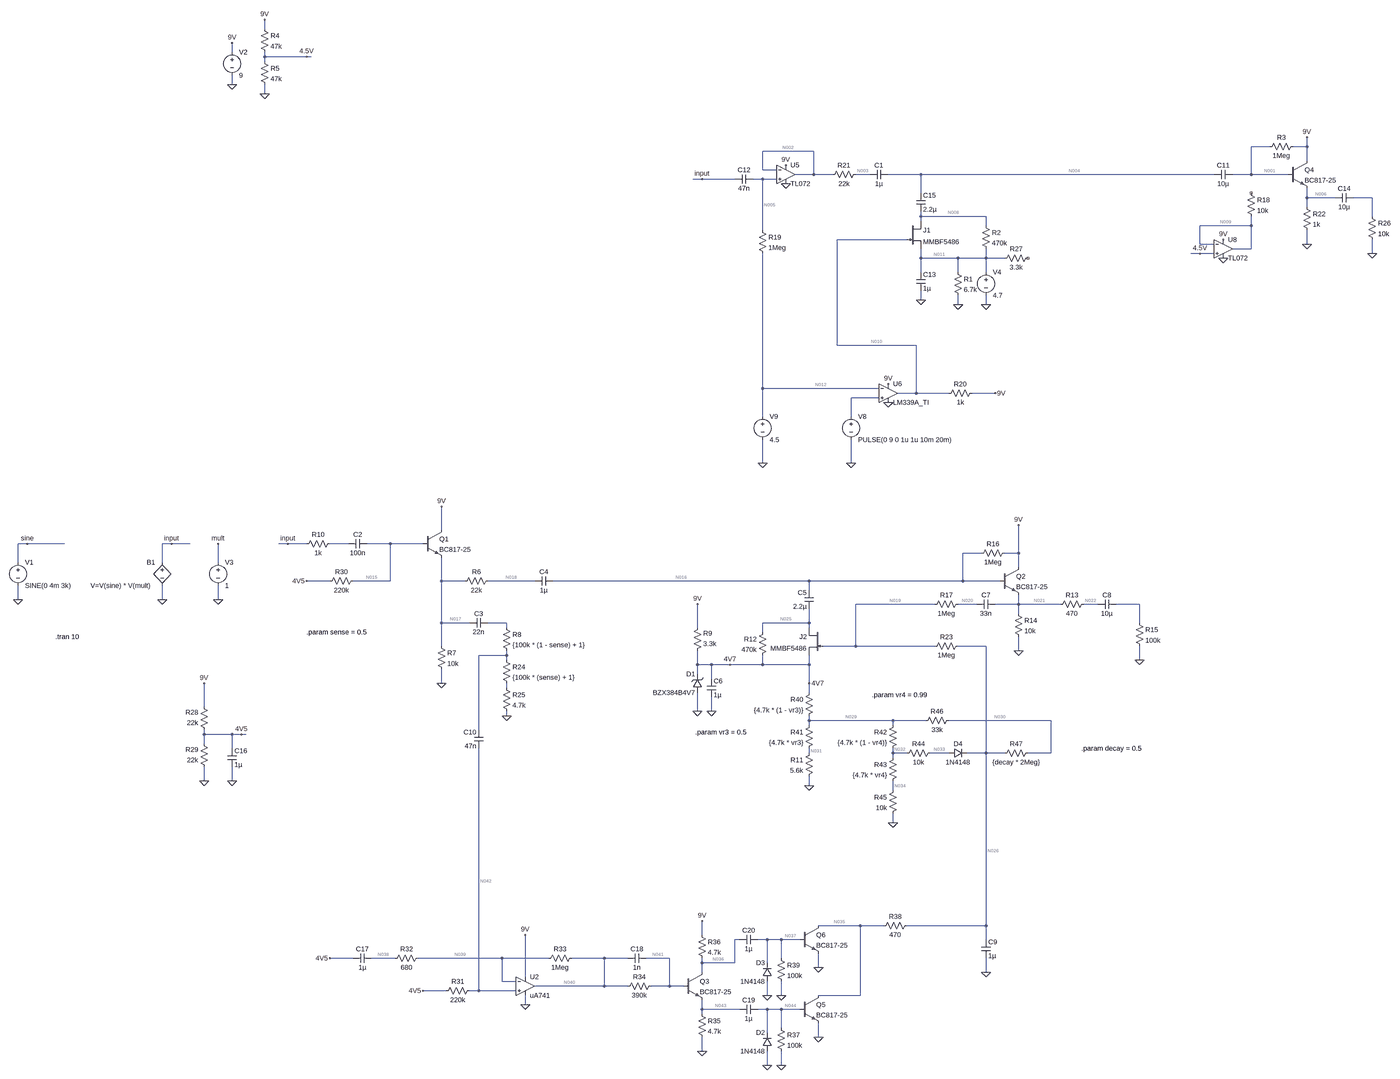
[diagram p0: schematic boss_NF1.asc, whole sheet]
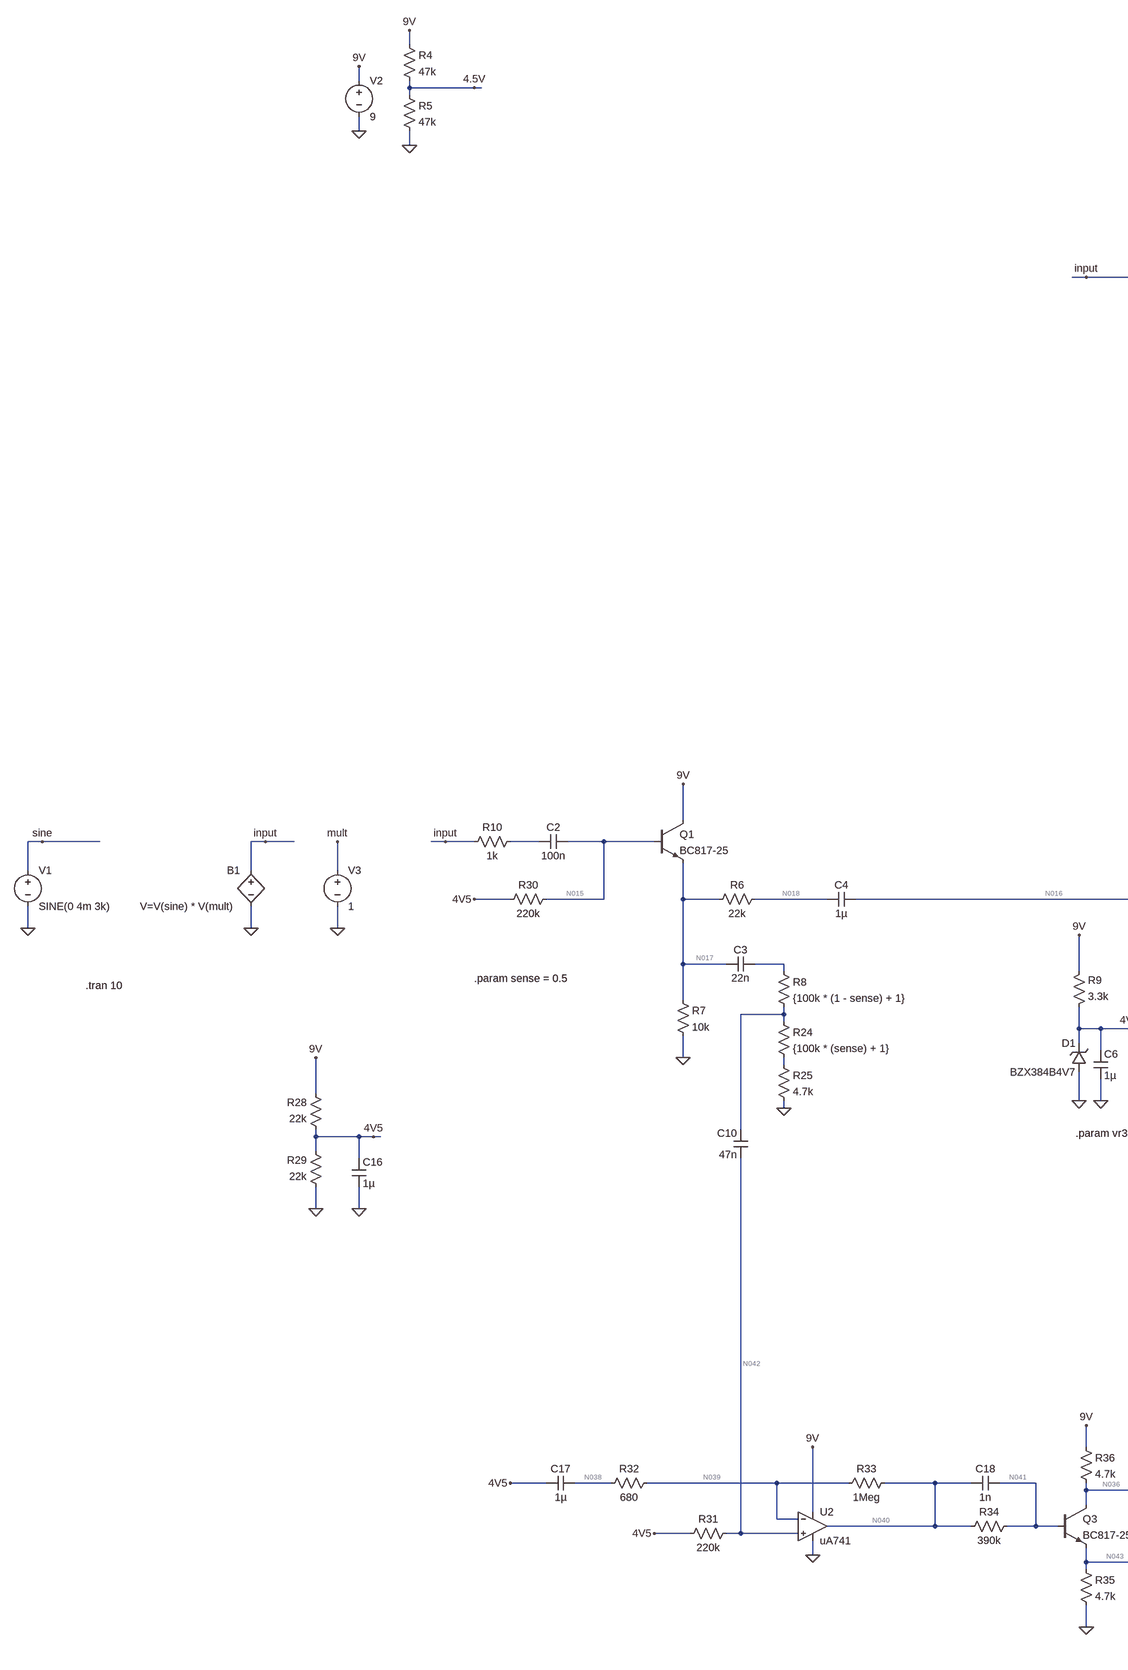
[diagram p1: schematic boss_NF1.asc, part, row 1 of 1, column 1 of 2]
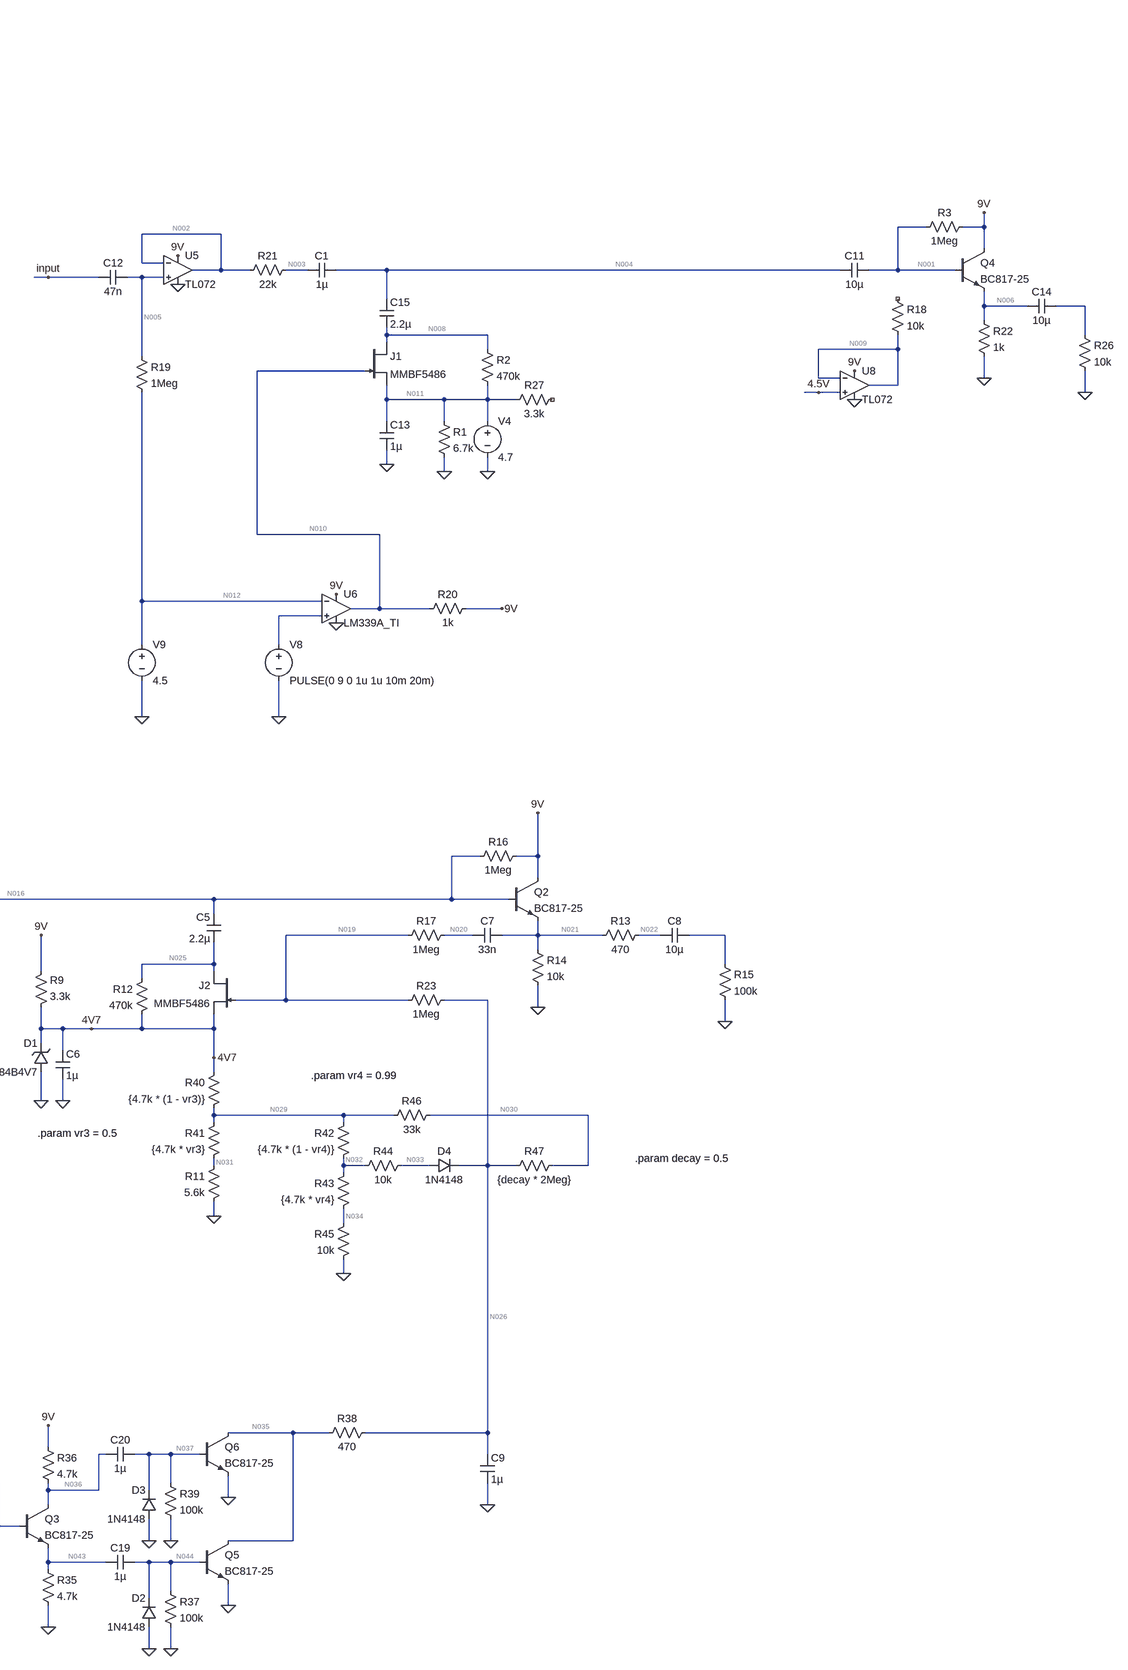
[diagram p2: schematic boss_NF1.asc, part, row 1 of 1, column 2 of 2]
boss_NF1.asc, the LTspice schematic file:
Version 4
SHEET 1 4932 4532
WIRE -656 -464 -656 -496
WIRE -768 -384 -768 -416
WIRE -656 -368 -656 -384
WIRE -512 -368 -656 -368
WIRE -496 -368 -512 -368
WIRE -656 -352 -656 -368
WIRE -768 -272 -768 -304
WIRE -656 -240 -656 -272
WIRE 2848 176 2784 176
WIRE 2976 176 2976 144
WIRE 2976 176 2928 176
WIRE 1232 192 1056 192
WIRE 2976 224 2976 176
WIRE 1056 256 1056 192
WIRE 1104 256 1056 256
WIRE 1232 272 1232 192
WIRE 1232 272 1168 272
WIRE 1296 272 1232 272
WIRE 1424 272 1376 272
WIRE 1600 272 1488 272
WIRE 2656 272 1600 272
WIRE 2784 272 2784 176
WIRE 2784 272 2720 272
WIRE 2912 272 2784 272
WIRE 848 288 816 288
WIRE 960 288 848 288
WIRE 1056 288 1024 288
WIRE 1104 288 1056 288
WIRE 1600 336 1600 272
WIRE 2976 352 2976 320
WIRE 3072 352 2976 352
WIRE 3200 352 3136 352
WIRE 2976 384 2976 352
WIRE 1600 416 1600 400
WIRE 1824 416 1600 416
WIRE 3200 416 3200 352
WIRE 1600 432 1600 416
WIRE 1824 448 1824 416
WIRE 2784 448 2784 416
WIRE 2784 448 2608 448
WIRE 1056 464 1056 288
WIRE 1552 496 1312 496
WIRE 2608 512 2608 448
WIRE 2656 512 2608 512
WIRE 2976 512 2976 464
WIRE 2784 528 2784 448
WIRE 2784 528 2720 528
WIRE 2608 544 2576 544
WIRE 2656 544 2608 544
WIRE 3200 544 3200 496
WIRE 1600 560 1600 528
WIRE 1728 560 1600 560
WIRE 1824 560 1824 528
WIRE 1824 560 1728 560
WIRE 1888 560 1824 560
WIRE 1600 608 1600 560
WIRE 1728 608 1728 560
WIRE 1824 608 1824 560
WIRE 1600 704 1600 672
WIRE 1728 720 1728 688
WIRE 1824 720 1824 688
WIRE 1312 880 1312 496
WIRE 1584 880 1312 880
WIRE 1056 1040 1056 544
WIRE 1456 1040 1056 1040
WIRE 1584 1056 1584 880
WIRE 1584 1056 1520 1056
WIRE 1696 1056 1584 1056
WIRE 1856 1056 1776 1056
WIRE 1456 1072 1360 1072
WIRE 1056 1136 1056 1040
WIRE 1360 1136 1360 1072
WIRE 1056 1296 1056 1216
WIRE 1360 1296 1360 1216
WIRE -48 2416 -48 2336
WIRE -1472 2464 -1504 2464
WIRE -1344 2464 -1472 2464
WIRE -976 2464 -1008 2464
WIRE -912 2464 -976 2464
WIRE -576 2464 -608 2464
WIRE -512 2464 -576 2464
WIRE -368 2464 -432 2464
WIRE -224 2464 -304 2464
WIRE -112 2464 -224 2464
WIRE 1808 2496 1744 2496
WIRE 1936 2496 1936 2400
WIRE 1936 2496 1888 2496
WIRE -1504 2528 -1504 2464
WIRE -1008 2528 -1008 2464
WIRE -816 2528 -816 2464
WIRE 1936 2544 1936 2496
WIRE -432 2592 -512 2592
WIRE -224 2592 -224 2464
WIRE -224 2592 -352 2592
WIRE -48 2592 -48 2512
WIRE 32 2592 -48 2592
WIRE 272 2592 112 2592
WIRE 1216 2592 336 2592
WIRE 1744 2592 1744 2496
WIRE 1744 2592 1216 2592
WIRE 1872 2592 1744 2592
WIRE 1216 2624 1216 2592
WIRE -1504 2656 -1504 2608
WIRE -1008 2656 -1008 2608
WIRE -816 2656 -816 2608
WIRE 1648 2672 1376 2672
WIRE 1792 2672 1728 2672
WIRE 1936 2672 1936 2640
WIRE 1936 2672 1856 2672
WIRE 2080 2672 1936 2672
WIRE 2208 2672 2160 2672
WIRE 2352 2672 2272 2672
WIRE 1936 2704 1936 2672
WIRE -48 2736 -48 2592
WIRE 48 2736 -48 2736
WIRE 176 2736 112 2736
WIRE 1216 2736 1216 2688
WIRE 1216 2736 1056 2736
WIRE 2352 2736 2352 2672
WIRE 176 2752 176 2736
WIRE 832 2752 832 2672
WIRE 1216 2752 1216 2736
WIRE 1056 2768 1056 2736
WIRE -48 2816 -48 2736
WIRE 1376 2816 1376 2672
WIRE 1376 2816 1264 2816
WIRE 1648 2816 1376 2816
WIRE 1824 2816 1728 2816
WIRE 1936 2832 1936 2784
WIRE 176 2848 176 2832
WIRE 176 2848 80 2848
WIRE 176 2864 176 2848
WIRE 2352 2864 2352 2816
WIRE 832 2880 832 2832
WIRE 880 2880 832 2880
WIRE 944 2880 880 2880
WIRE 1056 2880 1056 2848
WIRE 1056 2880 944 2880
WIRE 1216 2880 1216 2848
WIRE 1216 2880 1056 2880
WIRE 832 2912 832 2880
WIRE 880 2928 880 2880
WIRE -48 2944 -48 2896
WIRE 1216 2944 1216 2880
WIRE 176 2960 176 2944
WIRE 1216 2976 1216 2944
WIRE -864 3024 -864 2944
WIRE 832 3040 832 2976
WIRE 880 3040 880 2992
WIRE 176 3056 176 3040
WIRE 1216 3072 1216 3056
WIRE 1504 3072 1216 3072
WIRE 1616 3072 1504 3072
WIRE 2048 3072 1696 3072
WIRE 1216 3088 1216 3072
WIRE 1504 3088 1504 3072
WIRE 80 3104 80 2848
WIRE -864 3120 -864 3104
WIRE -768 3120 -864 3120
WIRE -736 3120 -768 3120
WIRE -720 3120 -736 3120
WIRE -864 3152 -864 3120
WIRE -768 3168 -768 3120
WIRE 1216 3184 1216 3168
WIRE 1504 3184 1504 3168
WIRE 1552 3184 1504 3184
WIRE 1696 3184 1632 3184
WIRE 1824 3184 1824 2816
WIRE 1824 3184 1760 3184
WIRE 1888 3184 1824 3184
WIRE 2048 3184 2048 3072
WIRE 2048 3184 1968 3184
WIRE 1504 3200 1504 3184
WIRE -864 3280 -864 3232
WIRE -768 3280 -768 3232
WIRE 1216 3296 1216 3264
WIRE 1504 3312 1504 3280
WIRE 1504 3424 1504 3392
WIRE 1392 3856 1248 3856
WIRE 1472 3856 1392 3856
WIRE 1824 3856 1824 3184
WIRE 1824 3856 1552 3856
WIRE 848 3888 848 3840
WIRE 976 3904 960 3904
WIRE 1072 3904 1040 3904
WIRE 1120 3904 1072 3904
WIRE 1184 3904 1120 3904
WIRE 1824 3904 1824 3856
WIRE -352 3968 -432 3968
WIRE -208 3968 -288 3968
WIRE 160 3968 -128 3968
WIRE 320 3968 160 3968
WIRE 512 3968 400 3968
WIRE 592 3968 512 3968
WIRE 736 3968 656 3968
WIRE 1120 3968 1120 3904
WIRE 848 3984 848 3968
WIRE 960 3984 960 3904
WIRE 960 3984 848 3984
WIRE 1072 3984 1072 3904
WIRE 1248 4000 1248 3952
WIRE 848 4016 848 3984
WIRE 1824 4016 1824 3968
WIRE 240 4032 240 3888
WIRE 160 4048 160 3968
WIRE 208 4048 160 4048
WIRE 512 4064 512 3968
WIRE 512 4064 272 4064
WIRE 592 4064 512 4064
WIRE 736 4064 736 3968
WIRE 736 4064 672 4064
WIRE 784 4064 736 4064
WIRE -32 4080 -112 4080
WIRE 80 4080 80 3168
WIRE 80 4080 48 4080
WIRE 208 4080 80 4080
WIRE 1072 4096 1072 4048
WIRE 1120 4096 1120 4048
WIRE 1392 4096 1392 3856
WIRE 1392 4096 1248 4096
WIRE 240 4128 240 4096
WIRE 848 4144 848 4112
WIRE 976 4144 848 4144
WIRE 1072 4144 1040 4144
WIRE 1120 4144 1072 4144
WIRE 1184 4144 1120 4144
WIRE 848 4160 848 4144
WIRE 1120 4208 1120 4144
WIRE 1072 4224 1072 4144
WIRE 1248 4240 1248 4192
WIRE 848 4288 848 4240
WIRE 1072 4336 1072 4288
WIRE 1120 4336 1120 4288
FLAG -768 -416 9V
FLAG -768 -272 0
FLAG -656 -496 9V
FLAG -656 -240 0
FLAG -512 -368 4.5V
FLAG -1504 2656 0
FLAG -816 2656 0
FLAG -816 2464 mult
FLAG -1008 2656 0
FLAG -1472 2464 sine
FLAG -976 2464 input
FLAG 848 288 input
FLAG 1136 240 9V
FLAG 1136 304 0
FLAG 1360 1296 0
FLAG 1056 1296 0
FLAG 1488 1024 9V
FLAG 1488 1088 0
FLAG 2688 496 9V
FLAG 2688 560 0
FLAG 2608 544 4.5V
FLAG 2976 512 0
FLAG 2976 144 9V
FLAG 3200 544 0
FLAG 1856 1056 9V
FLAG 1600 704 0
FLAG 1824 720 0
FLAG 1728 720 0
FLAG -48 2944 0
FLAG -48 2336 9V
FLAG 176 3056 0
FLAG 880 3040 0
FLAG 1216 3296 0
FLAG 832 2672 9V
FLAG 832 3040 0
FLAG 1936 2832 0
FLAG 1936 2400 9V
FLAG 2352 2864 0
FLAG 1824 4016 0
FLAG 240 3888 9V
FLAG 240 4128 0
FLAG -768 3280 0
FLAG -864 3280 0
FLAG -864 2944 9V
FLAG -736 3120 4V5
FLAG -512 2592 4V5
FLAG -576 2464 input
FLAG -112 4080 4V5
FLAG -432 3968 4V5
FLAG 848 4288 0
FLAG 848 3840 9V
FLAG 1120 4336 0
FLAG 1072 4336 0
FLAG 1248 4240 0
FLAG 1120 4096 0
FLAG 1072 4096 0
FLAG 1248 4000 0
FLAG 944 2880 4V7
FLAG 1216 2944 4V7
FLAG 1504 3424 0
SYMBOL voltage -1504 2512 R0
WINDOW 123 0 0 Left 0
WINDOW 39 0 0 Left 0
SYMATTR InstName V1
SYMATTR Value SINE(0 4m 3k)
SYMBOL voltage -768 -400 R0
WINDOW 123 0 0 Left 0
WINDOW 39 0 0 Left 0
SYMATTR InstName V2
SYMATTR Value 9
SYMBOL res -672 -480 R0
SYMATTR InstName R4
SYMATTR Value 47k
SYMBOL res -672 -368 R0
SYMATTR InstName R5
SYMATTR Value 47k
SYMBOL voltage -816 2512 R0
WINDOW 123 0 0 Left 0
WINDOW 39 0 0 Left 0
SYMATTR InstName V3
SYMATTR Value 1
SYMBOL bv -1008 2512 M0
WINDOW 3 40 96 Left 2
SYMATTR Value V=V(sine) * V(mult)
SYMATTR InstName B1
SYMBOL ZZZ\\OpAmp\\TL072 1136 272 R0
SYMATTR InstName U5
SYMBOL cap 2720 256 R90
WINDOW 0 0 32 VBottom 2
WINDOW 3 32 32 VTop 2
SYMATTR InstName C11
SYMATTR Value 10µ
SYMBOL res 2768 320 R0
SYMATTR InstName R18
SYMATTR Value 10k
SYMBOL res 1040 448 R0
SYMATTR InstName R19
SYMATTR Value 1Meg
SYMBOL cap 1024 272 R90
WINDOW 0 0 32 VBottom 2
WINDOW 3 32 32 VTop 2
SYMATTR InstName C12
SYMATTR Value 47n
SYMBOL voltage 1360 1120 R0
WINDOW 123 0 0 Left 0
WINDOW 39 0 0 Left 0
SYMATTR InstName V8
SYMATTR Value PULSE(0 9 0 1u 1u 10m 20m)
SYMBOL voltage 1056 1120 R0
WINDOW 123 0 0 Left 0
WINDOW 39 0 0 Left 0
SYMATTR InstName V9
SYMATTR Value 4.5
SYMBOL ZZZ\\Comparator\\LM339A_TI 1488 1056 R0
SYMATTR InstName U6
SYMBOL ZZZ\\OpAmp\\TL072 2688 528 R0
SYMATTR InstName U8
SYMBOL npn 2912 224 R0
SYMATTR InstName Q4
SYMATTR Value BC817-25
SYMBOL res 2960 368 R0
SYMATTR InstName R22
SYMATTR Value 1k
SYMBOL cap 3136 336 R90
WINDOW 0 0 32 VBottom 2
WINDOW 3 32 32 VTop 2
SYMATTR InstName C14
SYMATTR Value 10µ
SYMBOL res 3184 400 R0
SYMATTR InstName R26
SYMATTR Value 10k
SYMBOL njf 1552 432 R0
SYMATTR InstName J1
SYMATTR Value MMBF5486
SYMBOL res 1680 1072 R270
WINDOW 0 32 56 VTop 2
WINDOW 3 0 56 VBottom 2
SYMATTR InstName R20
SYMATTR Value 1k
SYMBOL res 1392 256 R90
WINDOW 0 0 56 VBottom 2
WINDOW 3 32 56 VTop 2
SYMATTR InstName R21
SYMATTR Value 22k
SYMBOL cap 1584 336 R0
SYMATTR InstName C15
SYMATTR Value 2.2µ
SYMBOL cap 1584 608 R0
SYMATTR InstName C13
SYMATTR Value 1µ
SYMBOL res 1984 544 R90
WINDOW 0 0 56 VBottom 2
WINDOW 3 32 56 VTop 2
SYMATTR InstName R27
SYMATTR Value 3.3k
SYMBOL cap 1488 256 R90
WINDOW 0 0 32 VBottom 2
WINDOW 3 32 32 VTop 2
SYMATTR InstName C1
SYMATTR Value 1µ
SYMBOL voltage 1824 592 R0
WINDOW 123 0 0 Left 0
WINDOW 39 0 0 Left 0
SYMATTR InstName V4
SYMATTR Value 4.7
SYMBOL res 1712 592 R0
SYMATTR InstName R1
SYMATTR Value 6.7k
SYMBOL res 1808 432 R0
SYMATTR InstName R2
SYMATTR Value 470k
SYMBOL res 2944 160 R90
WINDOW 0 0 56 VBottom 2
WINDOW 3 32 56 VTop 2
SYMATTR InstName R3
SYMATTR Value 1Meg
SYMBOL cap -304 2448 R90
WINDOW 0 0 32 VBottom 2
WINDOW 3 32 32 VTop 2
SYMATTR InstName C2
SYMATTR Value 100n
SYMBOL npn -112 2416 R0
SYMATTR InstName Q1
SYMATTR Value BC817-25
SYMBOL res -64 2800 R0
SYMATTR InstName R7
SYMATTR Value 10k
SYMBOL cap 112 2720 R90
WINDOW 0 0 32 VBottom 2
WINDOW 3 32 32 VTop 2
SYMATTR InstName C3
SYMATTR Value 22n
SYMBOL res 160 2736 R0
SYMATTR InstName R8
SYMATTR Value {100k * (1 - sense) + 1}
SYMBOL res -416 2448 R90
WINDOW 0 0 56 VBottom 2
WINDOW 3 32 56 VTop 2
SYMATTR InstName R10
SYMATTR Value 1k
SYMBOL res 128 2576 R90
WINDOW 0 0 56 VBottom 2
WINDOW 3 32 56 VTop 2
SYMATTR InstName R6
SYMATTR Value 22k
SYMBOL cap 336 2576 R90
WINDOW 0 0 32 VBottom 2
WINDOW 3 32 32 VTop 2
SYMATTR InstName C4
SYMATTR Value 1µ
SYMBOL njf 1264 2752 M0
SYMATTR InstName J2
SYMATTR Value MMBF5486
SYMBOL cap 1232 2624 M0
SYMATTR InstName C5
SYMATTR Value 2.2µ
SYMBOL cap 864 2928 R0
SYMATTR InstName C6
SYMATTR Value 1µ
SYMBOL res 816 2848 M180
WINDOW 0 36 76 Left 2
WINDOW 3 36 40 Left 2
SYMATTR InstName R9
SYMATTR Value 3.3k
SYMBOL res 1232 3168 M0
SYMATTR InstName R11
SYMATTR Value 5.6k
SYMBOL res 1072 2752 M0
SYMATTR InstName R12
SYMATTR Value 470k
SYMBOL zener 848 2976 R180
WINDOW 0 24 64 Left 2
WINDOW 3 24 0 Left 2
SYMATTR InstName D1
SYMATTR Value BZX384B4V7
SYMATTR Description Diode
SYMATTR Type diode
SYMBOL npn 1872 2544 R0
SYMATTR InstName Q2
SYMATTR Value BC817-25
SYMBOL res 1920 2688 R0
SYMATTR InstName R14
SYMATTR Value 10k
SYMBOL cap 2272 2656 R90
WINDOW 0 0 32 VBottom 2
WINDOW 3 32 32 VTop 2
SYMATTR InstName C8
SYMATTR Value 10µ
SYMBOL res 2336 2720 R0
SYMATTR InstName R15
SYMATTR Value 100k
SYMBOL res 1904 2480 R90
WINDOW 0 0 56 VBottom 2
WINDOW 3 32 56 VTop 2
SYMATTR InstName R16
SYMATTR Value 1Meg
SYMBOL res 2176 2656 R90
WINDOW 0 0 56 VBottom 2
WINDOW 3 32 56 VTop 2
SYMATTR InstName R13
SYMATTR Value 470
SYMBOL res 1744 2656 R90
WINDOW 0 0 56 VBottom 2
WINDOW 3 32 56 VTop 2
SYMATTR InstName R17
SYMATTR Value 1Meg
SYMBOL cap 1856 2656 R90
WINDOW 0 0 32 VBottom 2
WINDOW 3 32 32 VTop 2
SYMATTR InstName C7
SYMATTR Value 33n
SYMBOL res 1744 2800 R90
WINDOW 0 0 56 VBottom 2
WINDOW 3 32 56 VTop 2
SYMATTR InstName R23
SYMATTR Value 1Meg
SYMBOL cap 1808 3904 R0
SYMATTR InstName C9
SYMATTR Value 1µ
SYMBOL ValVol\\ST\\OpAmp\\uA741 240 4000 R0
SYMATTR InstName U2
SYMBOL res 160 2848 R0
SYMATTR InstName R24
SYMATTR Value {100k * (sense) + 1}
SYMBOL res 160 2944 R0
SYMATTR InstName R25
SYMATTR Value 4.7k
SYMBOL cap 96 3168 R180
WINDOW 0 24 56 Left 2
WINDOW 3 24 8 Left 2
SYMATTR InstName C10
SYMATTR Value 47n
SYMBOL res -848 3120 R180
WINDOW 0 36 76 Left 2
WINDOW 3 36 40 Left 2
SYMATTR InstName R28
SYMATTR Value 22k
SYMBOL cap -784 3168 R0
SYMATTR InstName C16
SYMATTR Value 1µ
SYMBOL res -848 3248 R180
WINDOW 0 36 76 Left 2
WINDOW 3 36 40 Left 2
SYMATTR InstName R29
SYMATTR Value 22k
SYMBOL res -336 2576 R90
WINDOW 0 0 56 VBottom 2
WINDOW 3 32 56 VTop 2
SYMATTR InstName R30
SYMATTR Value 220k
SYMBOL res 64 4064 R90
WINDOW 0 0 56 VBottom 2
WINDOW 3 32 56 VTop 2
SYMATTR InstName R31
SYMATTR Value 220k
SYMBOL cap -288 3952 R90
WINDOW 0 0 32 VBottom 2
WINDOW 3 32 32 VTop 2
SYMATTR InstName C17
SYMATTR Value 1µ
SYMBOL res -112 3952 R90
WINDOW 0 0 56 VBottom 2
WINDOW 3 32 56 VTop 2
SYMATTR InstName R32
SYMATTR Value 680
SYMBOL res 416 3952 R90
WINDOW 0 0 56 VBottom 2
WINDOW 3 32 56 VTop 2
SYMATTR InstName R33
SYMATTR Value 1Meg
SYMBOL res 688 4048 R90
WINDOW 0 0 56 VBottom 2
WINDOW 3 32 56 VTop 2
SYMATTR InstName R34
SYMATTR Value 390k
SYMBOL cap 656 3952 R90
WINDOW 0 0 32 VBottom 2
WINDOW 3 32 32 VTop 2
SYMATTR InstName C18
SYMATTR Value 1n
SYMBOL npn 784 4016 R0
SYMATTR InstName Q3
SYMATTR Value BC817-25
SYMBOL res 832 4144 R0
SYMATTR InstName R35
SYMATTR Value 4.7k
SYMBOL res 832 3872 R0
SYMATTR InstName R36
SYMATTR Value 4.7k
SYMBOL npn 1184 4096 R0
SYMATTR InstName Q5
SYMATTR Value BC817-25
SYMBOL res 1104 4192 R0
SYMATTR InstName R37
SYMATTR Value 100k
SYMBOL diode 1088 4288 R180
WINDOW 0 24 64 Left 2
WINDOW 3 24 0 Left 2
SYMATTR InstName D2
SYMATTR Value 1N4148
SYMBOL res 1456 3872 R270
WINDOW 0 32 56 VTop 2
WINDOW 3 0 56 VBottom 2
SYMATTR InstName R38
SYMATTR Value 470
SYMBOL npn 1184 3856 R0
SYMATTR InstName Q6
SYMATTR Value BC817-25
SYMBOL res 1104 3952 R0
SYMATTR InstName R39
SYMATTR Value 100k
SYMBOL diode 1088 4048 R180
WINDOW 0 24 64 Left 2
WINDOW 3 24 0 Left 2
SYMATTR InstName D3
SYMATTR Value 1N4148
SYMBOL cap 1040 4128 R90
WINDOW 0 0 32 VBottom 2
WINDOW 3 32 32 VTop 2
SYMATTR InstName C19
SYMATTR Value 1µ
SYMBOL cap 1040 3888 R90
WINDOW 0 0 32 VBottom 2
WINDOW 3 32 32 VTop 2
SYMATTR InstName C20
SYMATTR Value 1µ
SYMBOL res 1232 2960 M0
SYMATTR InstName R40
SYMATTR Value {4.7k * (1 - vr3)}
SYMBOL res 1232 3072 M0
SYMATTR InstName R41
SYMATTR Value {4.7k * vr3}
SYMBOL res 1520 3072 M0
SYMATTR InstName R42
SYMATTR Value {4.7k * (1 - vr4)}
SYMBOL res 1520 3184 M0
SYMATTR InstName R43
SYMATTR Value {4.7k * vr4}
SYMBOL diode 1696 3200 R270
WINDOW 0 32 32 VTop 2
WINDOW 3 0 32 VBottom 2
SYMATTR InstName D4
SYMATTR Value 1N4148
SYMBOL res 1648 3168 R90
WINDOW 0 0 56 VBottom 2
WINDOW 3 32 56 VTop 2
SYMATTR InstName R44
SYMATTR Value 10k
SYMBOL res 1520 3296 M0
SYMATTR InstName R45
SYMATTR Value 10k
SYMBOL res 1712 3056 R90
WINDOW 0 0 56 VBottom 2
WINDOW 3 32 56 VTop 2
SYMATTR InstName R46
SYMATTR Value 33k
SYMBOL res 1984 3168 R90
WINDOW 0 0 56 VBottom 2
WINDOW 3 32 56 VTop 2
SYMATTR InstName R47
SYMATTR Value {decay * 2Meg}
TEXT -1376 2784 Left 2 !.tran 10
TEXT -512 2768 Left 2 !.param sense = 0.5
TEXT 824 3112 Left 2 !.param vr3 = 0.5
TEXT 1432 2984 Left 2 !.param vr4 = 0.99
TEXT 2152 3168 Left 2 !.param decay = 0.5

The netlist it stands for:
* boss_NF1.asc
V1 sine 0 SINE(0 4m 3k)
V2 9V 0 9
R4 9V 4.5V 47k
R5 4.5V 0 47k
V3 mult 0 1
B1 input 0 V=V(sine) * V(mult)
* U5: TL072 (symbol ZZZ\OpAmp\TL072 not available, pins judged from their places): In+=N005 In-=N002 V+=9V V-=0 OUT=N002
C11 N001 N004 10µ
R18 NC_01 N009 10k
R19 N005 N012 1Meg
C12 N005 input 47n
V8 N013 0 PULSE(0 9 0 1u 1u 10m 20m)
V9 N012 0 4.5
* U6: LM339A_TI (symbol ZZZ\Comparator\LM339A_TI not available, pins judged from their places): In+=N013 In-=N012 V+=9V V-=0 OUT=N010
* U8: TL072 (symbol ZZZ\OpAmp\TL072 not available, pins judged from their places): In+=4.5V In-=N009 V+=9V V-=0 OUT=N009
Q4 9V N001 N006 0 BC817-25
R22 N006 0 1k
C14 N007 N006 10µ
R26 N007 0 10k
J1 N008 N010 N011 MMBF5486
R20 N010 9V 1k
R21 N003 N002 22k
C15 N004 N008 2.2µ
C13 N011 0 1µ
R27 NC_02 N011 3.3k
C1 N004 N003 1µ
V4 N011 0 4.7
R1 N011 0 6.7k
R2 N008 N011 470k
R3 9V N001 1Meg
C2 N015 N014 100n
Q1 9V N015 N017 0 BC817-25
R7 N017 0 10k
C3 N024 N017 22n
R8 N024 N027 {100k * (1 - sense) + 1}
R10 N014 input 1k
R6 N018 N017 22k
C4 N016 N018 1µ
J2 N025 N019 4V7 MMBF5486
C5 N016 N025 2.2µ
C6 4V7 0 1µ
R9 4V7 9V 3.3k
R11 N031 0 5.6k
R12 N025 4V7 470k
D1 0 4V7 BZX384B4V7
Q2 9V N016 N021 0 BC817-25
R14 N021 0 10k
C8 N023 N022 10µ
R15 N023 0 100k
R16 9V N016 1Meg
R13 N022 N021 470
R17 N020 N019 1Meg
C7 N021 N020 33n
R23 N026 N019 1Meg
C9 N026 0 1µ
* U2: uA741 (symbol ValVol\ST\OpAmp\uA741 not available, pins judged from their places): In+=N042 In-=N039 V+=9V V-=0 OUT=N040
R24 N027 N028 {100k * (sense) + 1}
R25 N028 0 4.7k
C10 N042 N027 47n
R28 4V5 9V 22k
C16 4V5 0 1µ
R29 0 4V5 22k
R30 N015 4V5 220k
R31 N042 4V5 220k
C17 N038 4V5 1µ
R32 N039 N038 680
R33 N040 N039 1Meg
R34 N041 N040 390k
C18 N041 N040 1n
Q3 N036 N041 N043 0 BC817-25
R35 N043 0 4.7k
R36 9V N036 4.7k
Q5 N035 N044 0 0 BC817-25
R37 N044 0 100k
D2 0 N044 1N4148
R38 N035 N026 470
Q6 N035 N037 0 0 BC817-25
R39 N037 0 100k
D3 0 N037 1N4148
C19 N044 N043 1µ
C20 N037 N036 1µ
R40 4V7 N029 {4.7k * (1 - vr3)}
R41 N029 N031 {4.7k * vr3}
R42 N029 N032 {4.7k * (1 - vr4)}
R43 N032 N034 {4.7k * vr4}
D4 N033 N026 1N4148
R44 N033 N032 10k
R45 N034 0 10k
R46 N030 N029 33k
R47 N030 N026 {decay * 2Meg}
.model D D
.lib standard.dio
.model NPN NPN
.model PNP PNP
.lib standard.bjt
.model NJF NJF
.model PJF PJF
.lib standard.jft
.tran 10
.param sense = 0.5
.param vr3 = 0.5
.param vr4 = 0.99
.param decay = 0.5
.backanno
.end

* Results of the author's LTspice run, read from the files saved beside the schematic
* Operating Point, zero values left out:
*   V(9v) = 9 V
*   V(4.5v) = 4.5 V
*   V(mult) = 1 V
*   V(n002) = 4.5 V
*   V(n005) = 4.5 V
*   V(n001) = 2.789 V
*   V(n004) = 42.73 µV
*   V(n009) = 4.5 V
*   V(n012) = 4.5 V
*   V(n010) = 117.6 mV
*   V(n006) = 2.17 V
*   V(n008) = 4.7 V
*   V(n011) = 4.7 V
*   V(n003) = 4.5 V
*   V(n015) = 4.254 V
*   V(n017) = 3.681 V
*   V(n018) = 3.681 V
*   V(n016) = 7.077 V
*   V(n025) = 4.649 V
*   V(n019) = 3.194 V
*   V(4v7) = 4.649 V
*   V(n031) = 2.25 V
*   V(n021) = 6.488 V
*   V(n022) = 6.488 V
*   V(n020) = 3.194 V
*   V(n026) = 3.194 V
*   V(n040) = 4.55 V
*   V(n039) = 4.47 V
*   V(n042) = 4.47 V
*   V(4v5) = 4.487 V
*   V(n038) = 4.47 V
*   V(n041) = 3.769 V
*   V(n036) = 5.83 V
*   V(n043) = 3.179 V
*   V(n035) = 3.194 V
*   V(n044) = 318.4 nV
*   V(n037) = 318.4 nV
*   V(n029) = 3.194 V
*   V(n032) = 3.184 V
*   V(n034) = 2.173 V
*   V(n033) = 3.184 V
*   V(n030) = 3.194 V
*   Ic(Q6) = 3.295 pA
*   Ib(Q6) = -3.202 pA
*   Ic(Q5) = 3.295 pA
*   Ib(Q5) = -3.202 pA
*   Ic(Q3) = 674.4 µA
*   Ib(Q3) = 2.003 µA
*   Ie(Q3) = -676.4 µA
*   Ic(Q2) = 646.9 µA
*   Ib(Q2) = 1.923 µA
*   Ie(Q2) = -648.8 µA
*   Ic(Q1) = 367 µA
*   Ib(Q1) = 1.062 µA
*   Ie(Q1) = -368.1 µA
*   Ic(Q4) = 2.164 mA
*   Ib(Q4) = 6.211 µA
*   Ie(Q4) = -2.17 mA
*   I(D4) = -485.7 pA
*   I(D1) = -699.2 µA
*   Ig(J2) = -2.931 pA
*   Is(J2) = 2.931 pA
*   Id(J1) = 4.592 pA
*   Ig(J1) = -9.185 pA
*   Is(J1) = 4.592 pA
*   I(R47) = 489.4 pA
*   I(R46) = -489.4 pA
*   I(R45) = 217.3 µA
*   I(R44) = 485.7 pA
*   I(R43) = 217.3 µA
*   I(R42) = 217.3 µA
*   I(R41) = 401.8 µA
*   I(R40) = 619.1 µA
*   I(R39) = 3.184 pA
*   I(R38) = -6.593 pA
*   I(R37) = 3.184 pA
*   I(R36) = 674.4 µA
*   I(R35) = 676.4 µA
*   I(R34) = -2.003 µA
*   I(R33) = 79.76 nA
*   I(R31) = -79.72 nA
*   I(R30) = -1.062 µA
*   I(R29) = -204 µA
*   I(R28) = -205.1 µA
*   I(R23) = -2.931 pA
*   I(R16) = 1.923 µA
*   I(R14) = 648.8 µA
*   I(R11) = 401.8 µA
*   I(R9) = -1.318 mA
*   I(R7) = 368.1 µA
*   I(R3) = 6.211 µA
*   I(R2) = -4.593 pA
*   I(R1) = 701.5 µA
*   I(R20) = -8.882 mA
*   I(R22) = 2.17 mA
*   I(R19) = -34.55 pA
*   I(R5) = 95.74 µA
*   I(R4) = 95.74 µA
*   I(V4) = -701.5 µA
*   I(V9) = -43.42 pA
*   I(V8) = 49.98 nA
*   I(V2) = -23.86 mA